# EAGLE design atmega328and644devboard (EAGLE 5.10)
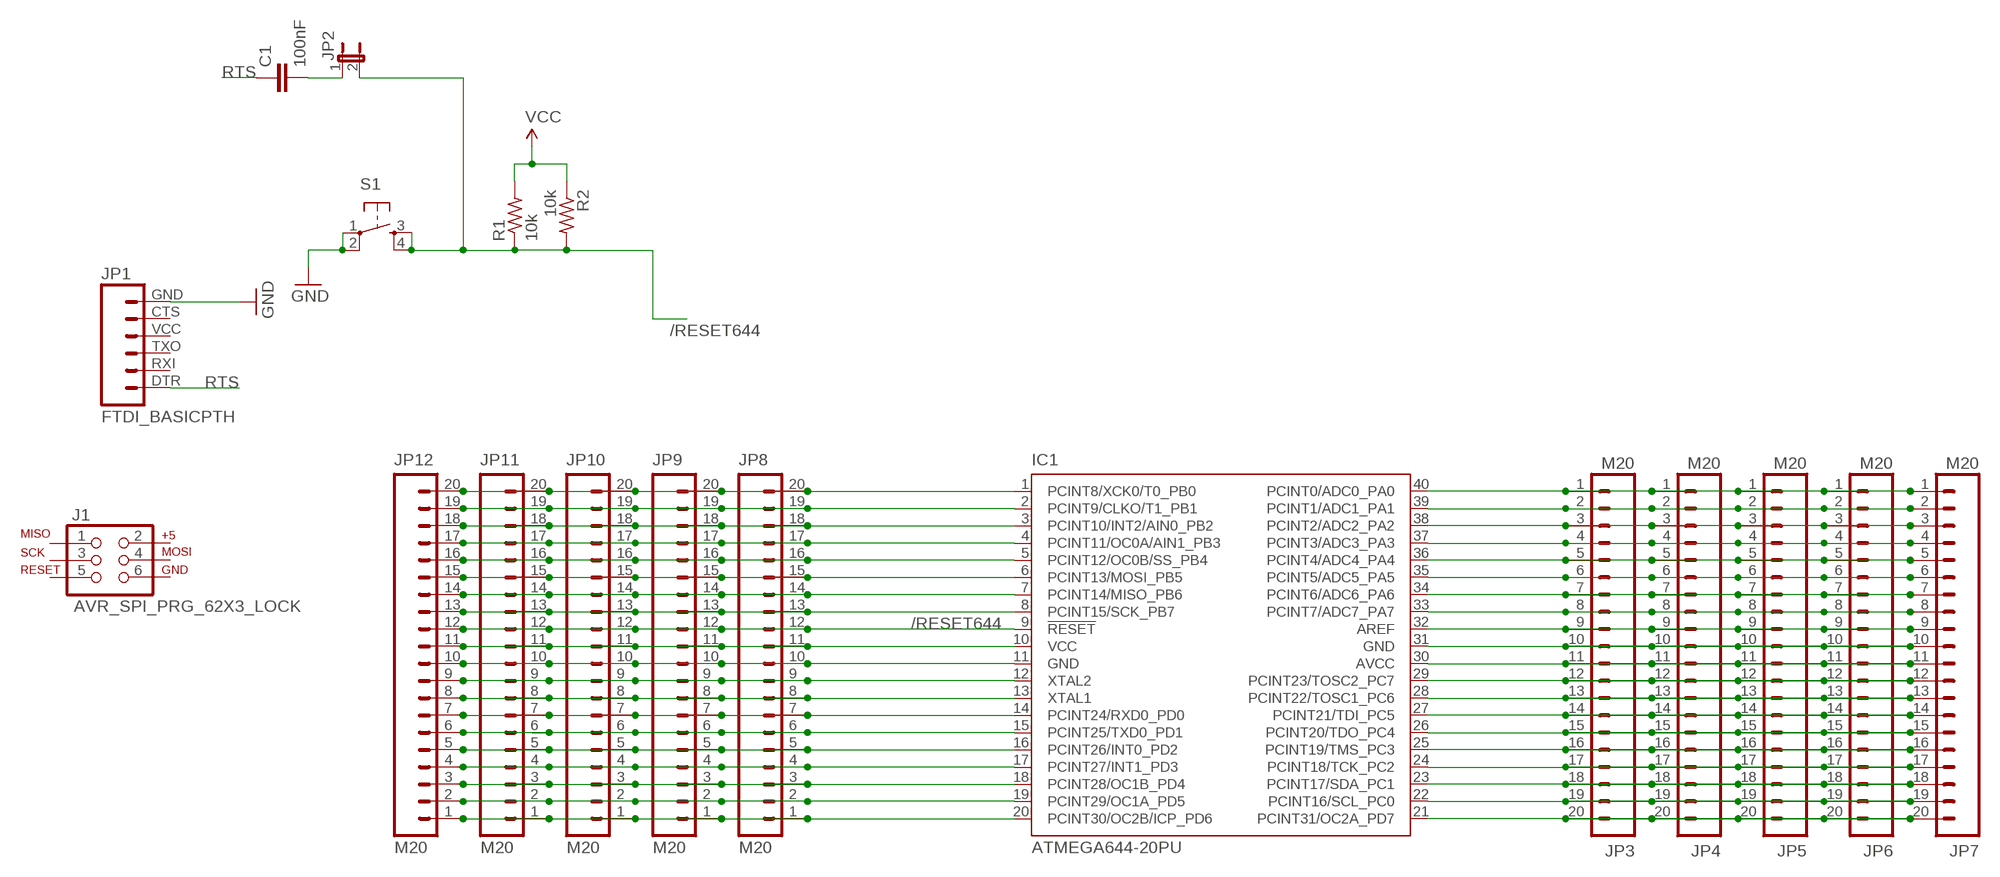
[diagram p0: schematic, sheet 1]

## Parts
C1  100nF  CAPPTH1  [CAP-PTH-5MM]
IC1  ATMEGA644-20PU  [DIL40]
J1  AVR_SPI_PRG_62X3_LOCK  [2X3_LOCK]
JP1  FTDI_BASICPTH  [FTDI_BASIC]
JP2  JUMPER-2PTH_LOCK  [1X02_LOCK]
JP3  M20  [1X20]
JP4  M20  [1X20]
JP5  M20  [1X20]
JP6  M20  [1X20]
JP7  M20  [1X20]
JP8  M20  [1X20]
JP9  M20  [1X20]
JP10  M20  [1X20]
JP11  M20  [1X20]
JP12  M20  [1X20]
R1  10k  R-US_0309/12  [0309/12]
R2  10k  R-US_R0805  [R0805]
S1  TAC_SWITCHPTH  [TACTILE-PTH]

## Nets
/RESET644: IC1.9(!RESET) JP2.2 JP8.12 JP9.12 JP10.12 JP11.12 JP12.12 R1.1 R2.2 S1.3 S1.4
GND: JP1.GND S1.1 S1.2
N$1: IC1.1(PCINT8/XCK0/T0_PB0) JP8.20 JP9.20 JP10.20 JP11.20 JP12.20
N$2: IC1.2(PCINT9/CLKO/T1_PB1) JP8.19 JP9.19 JP10.19 JP11.19 JP12.19
N$3: IC1.3(PCINT10/INT2/AIN0_PB2) JP8.18 JP9.18 JP10.18 JP11.18 JP12.18
N$4: C1.2 JP2.1
N$5: IC1.4(PCINT11/OC0A/AIN1_PB3) JP8.17 JP9.17 JP10.17 JP11.17 JP12.17
N$6: IC1.5(PCINT12/OC0B/SS_PB4) JP8.16 JP9.16 JP10.16 JP11.16 JP12.16
N$7: IC1.6(PCINT13/MOSI_PB5) JP8.15 JP9.15 JP10.15 JP11.15 JP12.15
N$8: IC1.7(PCINT14/MISO_PB6) JP8.14 JP9.14 JP10.14 JP11.14 JP12.14
N$9: IC1.8(PCINT15/SCK_PB7) JP8.13 JP9.13 JP10.13 JP11.13 JP12.13
N$10: IC1.10(VCC) JP8.11 JP9.11 JP10.11 JP11.11 JP12.11
N$11: IC1.11(GND) JP8.10 JP9.10 JP10.10 JP11.10 JP12.10
N$12: IC1.13(XTAL1) JP8.8 JP9.8 JP10.8 JP11.8 JP12.8
N$13: IC1.12(XTAL2) JP8.9 JP9.9 JP10.9 JP11.9 JP12.9
N$14: IC1.14(PCINT24/RXD0_PD0) JP8.7 JP9.7 JP10.7 JP11.7 JP12.7
N$15: IC1.15(PCINT25/TXD0_PD1) JP8.6 JP9.6 JP10.6 JP11.6 JP12.6
N$16: IC1.16(PCINT26/INT0_PD2) JP8.5 JP9.5 JP10.5 JP11.5 JP12.5
N$17: IC1.17(PCINT27/INT1_PD3) JP8.4 JP9.4 JP10.4 JP11.4 JP12.4
N$18: IC1.18(PCINT28/OC1B_PD4) JP8.3 JP9.3 JP10.3 JP11.3 JP12.3
N$19: IC1.19(PCINT29/OC1A_PD5) JP8.2 JP9.2 JP10.2 JP11.2 JP12.2
N$20: IC1.20(PCINT30/OC2B/ICP_PD6) JP8.1 JP9.1 JP10.1 JP11.1 JP12.1
N$21: IC1.40(PCINT0/ADC0_PA0) JP3.1 JP4.1 JP5.1 JP6.1 JP7.1
N$22: IC1.39(PCINT1/ADC1_PA1) JP3.2 JP4.2 JP5.2 JP6.2 JP7.2
N$23: IC1.38(PCINT2/ADC2_PA2) JP3.3 JP4.3 JP5.3 JP6.3 JP7.3
N$24: IC1.37(PCINT3/ADC3_PA3) JP3.4 JP4.4 JP5.4 JP6.4 JP7.4
N$25: IC1.36(PCINT4/ADC4_PA4) JP3.5 JP4.5 JP5.5 JP6.5 JP7.5
N$26: IC1.35(PCINT5/ADC5_PA5) JP3.6 JP4.6 JP5.6 JP6.6 JP7.6
N$27: IC1.34(PCINT6/ADC6_PA6) JP3.7 JP4.7 JP5.7 JP6.7 JP7.7
N$28: IC1.33(PCINT7/ADC7_PA7) JP3.8 JP4.8 JP5.8 JP6.8 JP7.8
N$29: IC1.32(AREF) JP3.9 JP4.9 JP5.9 JP6.9 JP7.9
N$30: IC1.31(GND) JP3.10 JP4.10 JP5.10 JP6.10 JP7.10
N$31: IC1.30(AVCC) JP3.11 JP4.11 JP5.11 JP6.11 JP7.11
N$32: IC1.29(PCINT23/TOSC2_PC7) JP3.12 JP4.12 JP5.12 JP6.12 JP7.12
N$33: IC1.28(PCINT22/TOSC1_PC6) JP3.13 JP4.13 JP5.13 JP6.13 JP7.13
N$34: IC1.27(PCINT21/TDI_PC5) JP3.14 JP4.14 JP5.14 JP6.14 JP7.14
N$35: IC1.26(PCINT20/TDO_PC4) JP3.15 JP4.15 JP5.15 JP6.15 JP7.15
N$36: IC1.25(PCINT19/TMS_PC3) JP3.16 JP4.16 JP5.16 JP6.16 JP7.16
N$37: IC1.24(PCINT18/TCK_PC2) JP3.17 JP4.17 JP5.17 JP6.17 JP7.17
N$38: IC1.23(PCINT17/SDA_PC1) JP3.18 JP4.18 JP5.18 JP6.18 JP7.18
N$39: IC1.22(PCINT16/SCL_PC0) JP3.19 JP4.19 JP5.19 JP6.19 JP7.19
N$40: IC1.21(PCINT31/OC2A_PD7) JP3.20 JP4.20 JP5.20 JP6.20 JP7.20
RTS: C1.1 JP1.DTR
VCC: R1.2 R2.1
Unconnected: J1.1 J1.2 J1.3 J1.4 J1.5 J1.6 JP1.CTS JP1.RXI JP1.TXO JP1.VCC

## Library data of the parts
C1 = ideabot:CAP: Capacitor Standard 0603 ceramic capacitor, and 0.1" leaded capacitor.
IC1 = atmel:ATMEGA644-*PU: 8-bit Microcontroller with 64K Bytes In-System Programmable Flash Auto generated by make-symbol-device-package-bsdl.ulp Rev. 34 Source: http://www.atmel.com/dyn/resources/prod_documents/doc2593.pdf
J1 = SparkFun:AVR_SPI_PRG_6: AVR ISP 6 Pin This is the reduced ISP connector for AVR programming. Common on Arduino. This footprint will take up less PCB space and can be used with a 10-pin to 6-pin adapter such as SKU: BOB-08508
JP1 = SparkFun:FTDI_BASIC: FTDI Basic: 3.3V and 5V
JP2 = SparkFun:JUMPER-2: Jumper Basic 0.1" spaced jumper. Use with breakaway headers.
JP3-JP12 = SparkFun:M20: This is just like the LOCK variant in that the holes are staggared by 5 mil, but except for the last two holes. They are not altered from the "standard" footprint layout. This is used for a special purpose on the layout of our Graphic LCD Backpack. Make sure you want to use this device before selecting it for you project!
R1 R2 = adafruit:R-US_: RESISTOR, American symbol
S1 = SparkFun:TAC_SWITCH: Momentary Switch Button commonly used for reset or general input. Spark Fun Electronics SKU : COM-00097

## Board
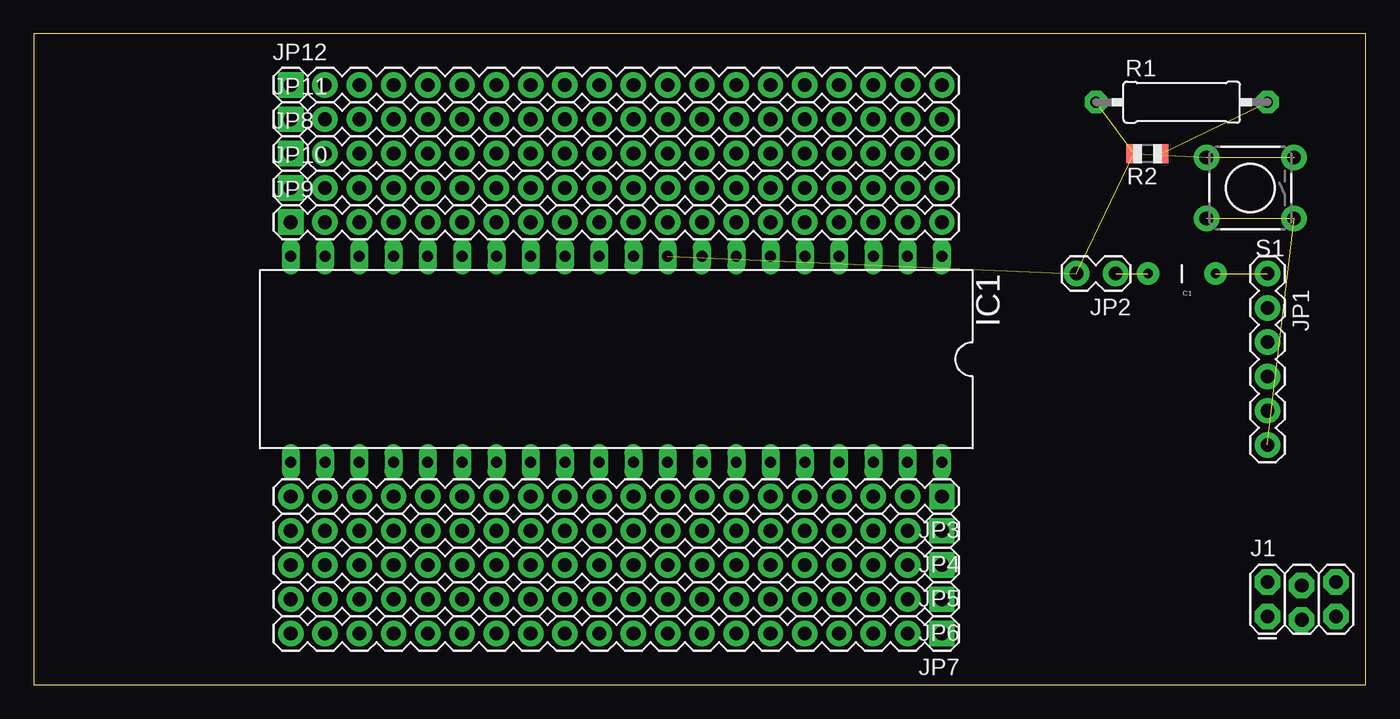
[diagram p1: board, top side]
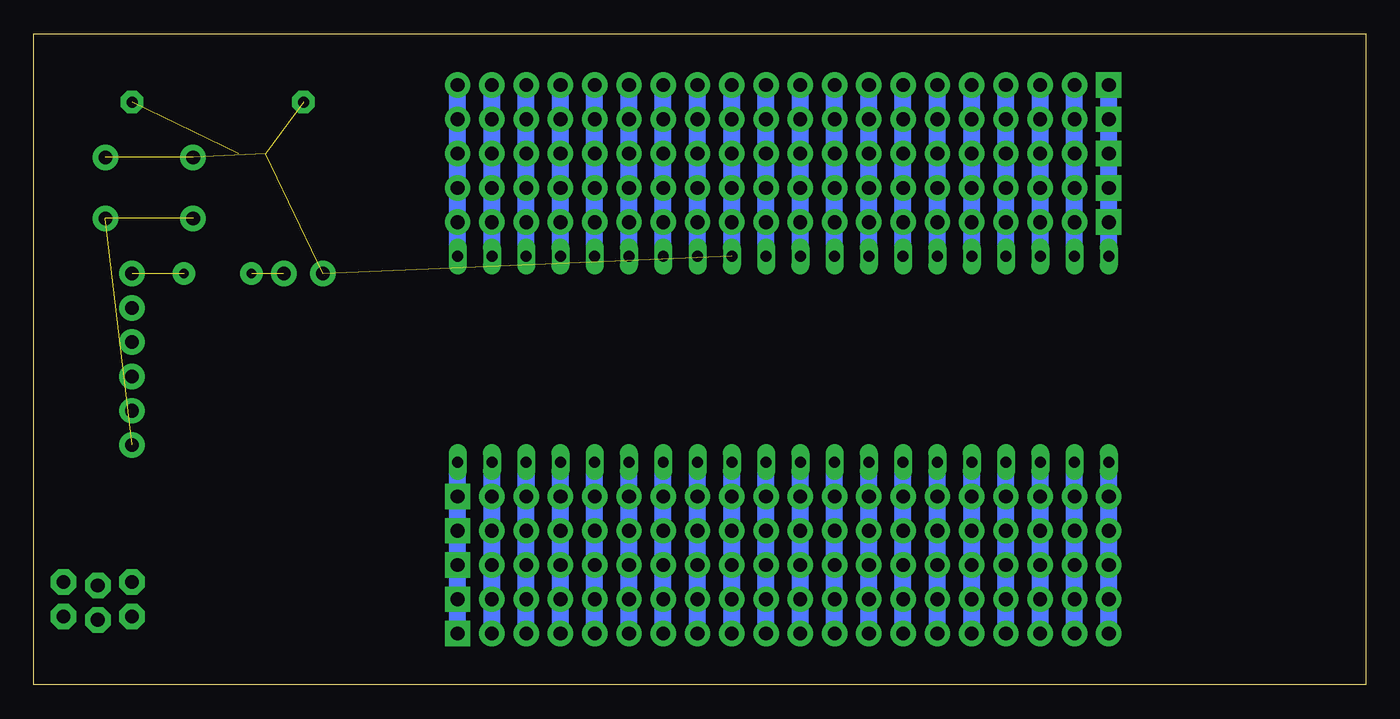
[diagram p2: board, bottom side, seen from below]

Size 98.73 x 48.25 mm. Coordinates in mm from the lower left corner, seen from the top.
Outline: 0,0 98.73,0 98.73,48.25 0,48.25 0,0
Copper layers (1*16): Top 0.035mm / dielectric 1.5mm / Bottom 0.035mm
Design rules "default": minimum track width 10mil, minimum drill 24mil, track to track 8mil, track to pad 8mil, pad to pad 8mil, via to via 8mil, smd to smd 8mil, copper to edge 40mil, drill to drill 8mil, minimum pad ring 10mil, minimum via ring 8mil, stop-mask expansion 4mil, vias tented up to drill 0mil, thermal gap 10mil

### Footprints (pad centres in the part's own frame; a part is rotated, then mirrored left to right if it is on the bottom)
CAP-PTH-5MM = drill 0.7 pad 1.651 round: 1 -2.5,0; 2 2.5,0
DIL40 = drill 0.813 long: 1 -24.13,-7.62; 2 -21.59,-7.62; 3 -19.05,-7.62; 4 -16.51,-7.62; 5 -13.97,-7.62; 6 -11.43,-7.62; 7 -8.89,-7.62; 8 -6.35,-7.62; 9 -3.81,-7.62; 10 -1.27,-7.62; 11 1.27,-7.62; 12 3.81,-7.62; 13 6.35,-7.62; 14 8.89,-7.62; 15 11.43,-7.62; 16 13.97,-7.62; 17 16.51,-7.62; 18 19.05,-7.62; 19 21.59,-7.62; 20 24.13,-7.62; 21 24.13,7.62; 22 21.59,7.62; 23 19.05,7.62; 24 16.51,7.62; 25 13.97,7.62; 26 11.43,7.62; 27 8.89,7.62; 28 6.35,7.62; 29 3.81,7.62; 30 1.27,7.62; 31 -1.27,7.62; 32 -3.81,7.62; 33 -6.35,7.62; 34 -8.89,7.62; 35 -11.43,7.62; 36 -13.97,7.62; 37 -16.51,7.62; 38 -19.05,7.62; 39 -21.59,7.62; 40 -24.13,7.62
2X3_LOCK = drill 1.016 pad 1.88 octagon: 1 0,0; 2 0,2.54; 3 2.54,-0.254; 4 2.54,2.286; 5 5.08,0; 6 5.08,2.54
FTDI_BASIC = drill 1.016 pad 1.88 round: CTS 10.16,0; DTR 0,0; GND 12.7,0; RXI 2.54,0; TXO 5.08,0; VCC 7.62,0
1X02_LOCK = drill 1.016 pad 1.88 round: 1 -0.178,0; 2 2.718,0
1X20 = drill 1.016 pad 1.88 square: 1 0,0 | drill 1.016 pad 1.88 round: 2 2.54,0; 3 5.08,0; 4 7.62,0; 5 10.16,0; 6 12.7,0; 7 15.24,0; 8 17.78,0; 9 20.32,0; 10 22.86,0; 11 25.4,0; 12 27.94,0; 13 30.48,0; 14 33.02,0; 15 35.56,0; 16 38.1,0; 17 40.64,0; 18 43.18,0; 19 45.72,0; 20 48.26,0
0309/12 = drill 0.813 pad 1.676 octagon: 1 -6.35,0; 2 6.35,0
R0805 = smd 1.1 x 1.4: 1 -1,0; 2 1,0
TACTILE-PTH = drill 1.016 pad 1.88 round: 1 -3.251,2.261; 2 3.251,2.261; 3 -3.251,-2.261; 4 3.251,-2.261

### Placement (x,y rotation side)
C1  85.09,30.48 180 top
IC1  43.18,24.13 180 top
J1  91.44,5.08 0 top
JP1  91.44,30.48 270 top
JP2  80.01,30.48 180 top
JP3  67.31,13.97 180 top
JP4  67.31,11.43 180 top
JP5  67.31,8.89 180 top
JP6  67.31,6.35 180 top
JP7  67.31,3.81 180 top
JP8  19.05,39.37 0 top
JP9  19.05,34.29 0 top
JP10  19.05,36.83 0 top
JP11  19.05,41.91 0 top
JP12  19.05,44.45 0 top
R1  85.09,43.18 0 top
R2  82.55,39.37 180 top
S1  90.17,36.83 180 top

### Tracks (layer width: path | path; a pad name or v marks a point on that pad's centre or on a via)
/RESET644  (5 unrouted)
  Bottom 1.27: JP12.12 JP11.12 JP8.12 JP10.12 JP9.12 IC1.9
GND  (2 unrouted)
N$1
  Bottom 1.27: IC1.1 JP9.20 JP10.20 JP8.20 JP11.20 JP12.20
N$2
  Bottom 1.27: JP12.19 JP11.19 JP8.19 JP10.19 JP9.19 IC1.2
N$3
  Bottom 1.27: JP12.18 JP11.18 JP8.18 JP10.18 JP9.18 IC1.3
N$4  (1 unrouted)
N$5
  Bottom 1.27: IC1.4 JP9.17 JP10.17 JP8.17 JP11.17 JP12.17
N$6
  Bottom 1.27: JP12.16 JP11.16 JP8.16 JP10.16 JP9.16 IC1.5
N$7
  Bottom 1.27: IC1.6 JP9.15 JP10.15 JP8.15 JP11.15 JP12.15
N$8
  Bottom 1.27: JP12.14 JP11.14 JP8.14 JP10.14 JP9.14 IC1.7
N$9
  Bottom 1.27: IC1.8 JP9.13 JP10.13 JP8.13 JP11.13 JP12.13
N$10
  Bottom 1.27: IC1.10 JP9.11 JP10.11 JP8.11 JP11.11 JP12.11
N$11
  Bottom 1.27: JP12.10 JP11.10 JP8.10 JP10.10 JP9.10 IC1.11
N$12
  Bottom 1.27: JP12.8 JP11.8 JP8.8 JP10.8 JP9.8 IC1.13
N$13
  Bottom 1.27: IC1.12 JP9.9 JP10.9 JP8.9 JP11.9 JP12.9
N$14
  Bottom 1.27: IC1.14 JP9.7 JP10.7 JP8.7 JP11.7 JP12.7
N$15
  Bottom 1.27: JP12.6 JP11.6 JP8.6 JP10.6 JP9.6 IC1.15
N$16
  Bottom 1.27: IC1.16 JP9.5 JP10.5 JP8.5 JP11.5 JP12.5
N$17
  Bottom 1.27: JP12.4 JP11.4 JP8.4 JP10.4 JP9.4 IC1.17
N$18
  Bottom 1.27: IC1.18 JP9.3 JP10.3 JP8.3 JP11.3 JP12.3
N$19
  Bottom 1.27: JP12.2 JP11.2 JP8.2 JP10.2 JP9.2 IC1.19
N$20
  Bottom 1.27: IC1.20 JP9.1 JP10.1 JP8.1 JP11.1 JP12.1
N$21
  Bottom 1.27: JP7.1 JP6.1 JP5.1 JP4.1 JP3.1 IC1.40
N$22
  Bottom 1.27: JP7.2 JP6.2 JP5.2 JP4.2 JP3.2 IC1.39
N$23
  Bottom 1.27: JP7.3 JP6.3 JP5.3 | JP5.3 JP4.3 JP3.3 IC1.38 JP5.3
N$24
  Bottom 1.27: JP7.4 JP6.4 JP5.4 JP4.4 JP3.4 IC1.37
N$25
  Bottom 1.27: JP7.5 JP6.5 JP5.5 JP4.5 JP3.5 IC1.36
N$26
  Bottom 1.27: JP7.6 JP6.6 JP5.6 JP4.6 JP3.6 IC1.35
N$27
  Bottom 1.27: JP7.7 JP6.7 JP5.7 JP4.7 JP3.7 IC1.34
N$28
  Bottom 1.27: JP7.8 JP6.8 JP5.8 JP4.8 JP3.8 IC1.33
N$29
  Bottom 1.27: IC1.32 JP3.9 JP4.9 JP5.9 JP6.9 JP7.9
N$30
  Bottom 1.27: JP7.10 JP6.10 JP5.10 JP4.10 JP3.10 IC1.31
N$31
  Bottom 1.27: IC1.30 JP3.11 JP4.11 JP5.11 JP6.11 JP7.11
N$32
  Bottom 1.27: JP7.12 JP6.12 JP5.12 JP4.12 JP3.12 IC1.29
N$33
  Bottom 1.27: IC1.28 JP3.13 JP4.13 JP5.13 JP6.13 JP7.13
N$34
  Bottom 1.27: JP7.14 JP6.14 JP5.14 JP4.14 JP3.14 IC1.27
N$35
  Bottom 1.27: IC1.26 JP3.15 JP4.15 JP5.15 JP6.15 JP7.15
N$36
  Bottom 1.27: JP7.16 JP6.16 JP5.16 JP4.16 JP3.16 IC1.25
N$37
  Bottom 1.27: IC1.24 JP3.17 JP4.17 JP5.17 JP6.17 JP7.17
N$38
  Bottom 1.27: JP7.18 JP6.18 JP5.18 JP4.18 JP3.18 IC1.23
N$39
  Bottom 1.27: IC1.22 JP3.19 JP4.19 JP5.19 JP6.19 JP7.19
N$40
  Bottom 1.27: JP7.20 JP6.20 JP5.20 JP4.20 JP3.20 IC1.21
RTS  (1 unrouted)
VCC  (1 unrouted)